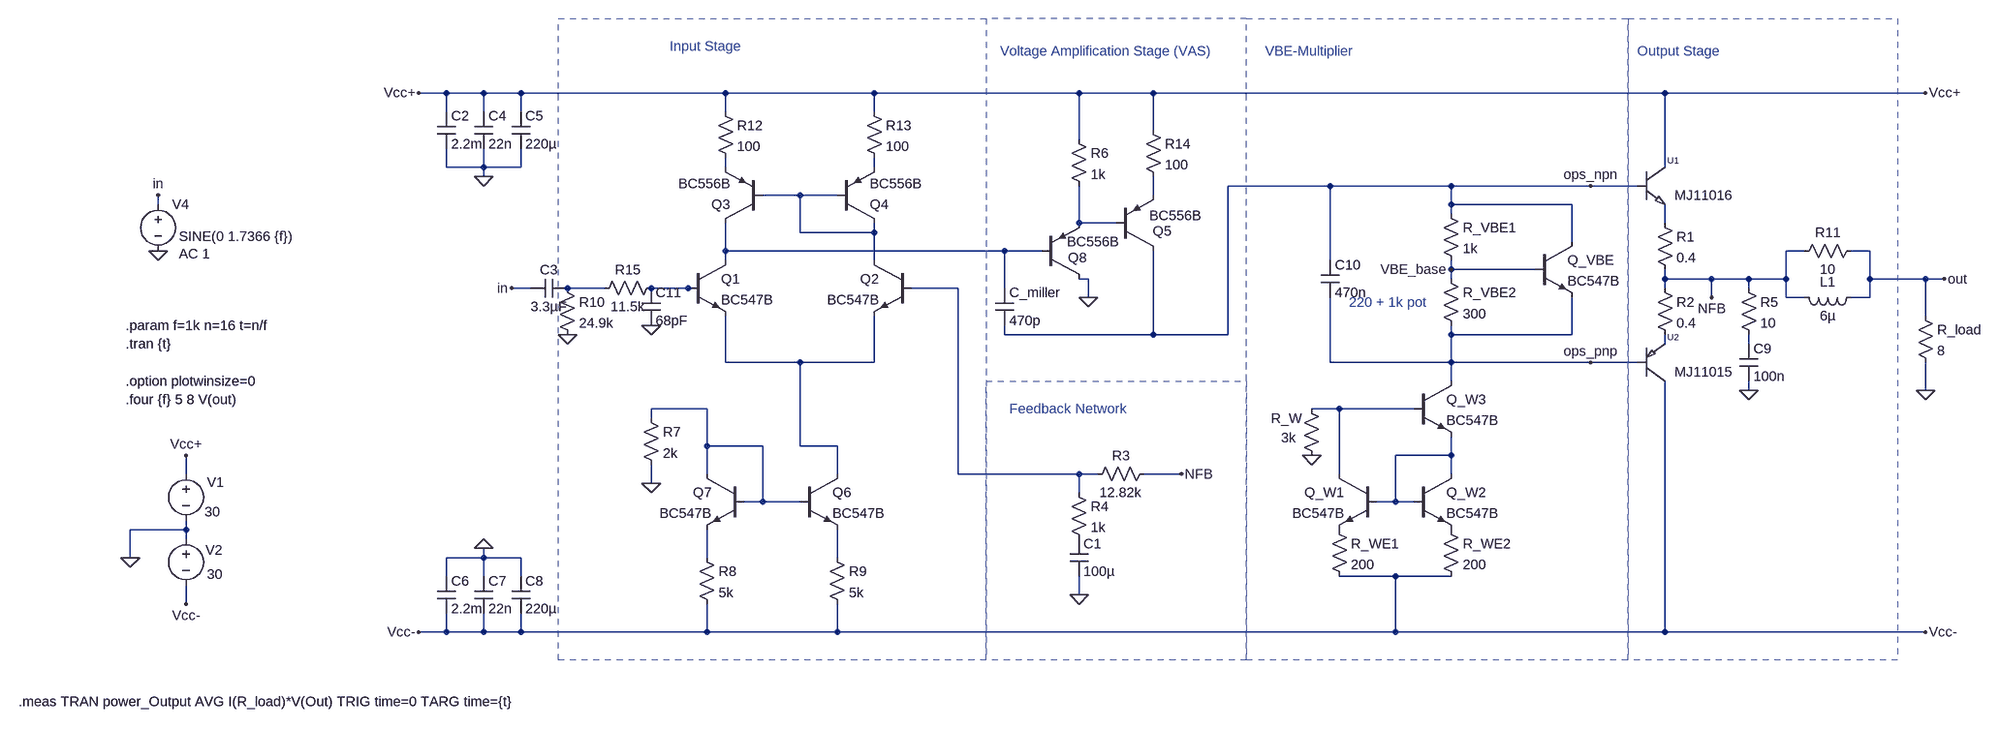
[diagram p0: schematic classABThreeStage.asc]
classABThreeStage.asc, the LTspice schematic file:
Version 4
SHEET 1 1384 792
WIRE -1392 -496 -1440 -496
WIRE -1328 -496 -1392 -496
WIRE -1264 -496 -1328 -496
WIRE -912 -496 -1264 -496
WIRE -656 -496 -912 -496
WIRE -304 -496 -656 -496
WIRE -176 -496 -304 -496
WIRE 704 -496 -176 -496
WIRE 1152 -496 704 -496
WIRE -1392 -464 -1392 -496
WIRE -1328 -464 -1328 -496
WIRE -1264 -464 -1264 -496
WIRE -912 -464 -912 -496
WIRE -656 -464 -656 -496
WIRE -176 -432 -176 -496
WIRE -304 -416 -304 -496
WIRE -1392 -368 -1392 -400
WIRE -1328 -368 -1328 -400
WIRE -1328 -368 -1392 -368
WIRE -1264 -368 -1264 -400
WIRE -1264 -368 -1328 -368
WIRE -912 -368 -912 -384
WIRE -656 -368 -656 -384
WIRE 704 -368 704 -496
WIRE -1328 -352 -1328 -368
WIRE 128 -336 -48 -336
WIRE 336 -336 128 -336
WIRE 576 -336 336 -336
WIRE 656 -336 576 -336
WIRE -784 -320 -848 -320
WIRE -720 -320 -784 -320
WIRE -176 -320 -176 -352
WIRE -1888 -304 -1888 -320
WIRE 336 -304 336 -336
WIRE 544 -304 336 -304
WIRE 336 -288 336 -304
WIRE -304 -272 -304 -336
WIRE -240 -272 -304 -272
WIRE 704 -272 704 -304
WIRE -784 -256 -784 -320
WIRE -656 -256 -656 -272
WIRE -656 -256 -784 -256
WIRE 544 -240 544 -304
WIRE -912 -224 -912 -272
WIRE -432 -224 -912 -224
WIRE -368 -224 -432 -224
WIRE 944 -224 912 -224
WIRE 1056 -224 1024 -224
WIRE -912 -208 -912 -224
WIRE -656 -208 -656 -256
WIRE 128 -208 128 -336
WIRE 336 -192 336 -208
WIRE 480 -192 336 -192
WIRE -288 -176 -304 -176
WIRE 336 -176 336 -192
WIRE 704 -176 704 -192
WIRE 784 -176 704 -176
WIRE 848 -176 784 -176
WIRE 912 -176 912 -224
WIRE 912 -176 848 -176
WIRE 1056 -176 1056 -224
WIRE 1152 -176 1056 -176
WIRE 1184 -176 1152 -176
WIRE -1248 -160 -1280 -160
WIRE -1120 -160 -1184 -160
WIRE -976 -160 -1040 -160
WIRE -960 -160 -976 -160
WIRE -512 -160 -592 -160
WIRE -432 -160 -432 -224
WIRE 704 -160 704 -176
WIRE 848 -160 848 -176
WIRE -288 -144 -288 -176
WIRE 784 -144 784 -176
WIRE 912 -144 912 -176
WIRE 944 -144 912 -144
WIRE 1056 -144 1056 -176
WIRE 1056 -144 1024 -144
WIRE 1152 -112 1152 -176
WIRE -432 -80 -432 -96
WIRE -176 -80 -176 -224
WIRE -176 -80 -432 -80
WIRE -48 -80 -48 -336
WIRE -48 -80 -176 -80
WIRE 336 -80 336 -96
WIRE 544 -80 544 -144
WIRE 544 -80 336 -80
WIRE 704 -64 704 -80
WIRE 848 -64 848 -80
WIRE -912 -32 -912 -112
WIRE -784 -32 -912 -32
WIRE -656 -32 -656 -112
WIRE -656 -32 -784 -32
WIRE 128 -32 128 -144
WIRE 336 -32 336 -80
WIRE 336 -32 128 -32
WIRE 576 -32 336 -32
WIRE 656 -32 576 -32
WIRE 336 0 336 -32
WIRE 848 16 848 0
WIRE 1152 16 1152 -32
WIRE -944 48 -1040 48
WIRE 144 48 96 48
WIRE 272 48 144 48
WIRE -1040 64 -1040 48
WIRE -944 112 -944 48
WIRE -848 112 -944 112
WIRE -784 112 -784 -32
WIRE -720 112 -784 112
WIRE 336 128 336 96
WIRE 336 128 240 128
WIRE -1840 160 -1840 128
WIRE -944 160 -944 112
WIRE -720 160 -720 112
WIRE -512 160 -512 -160
WIRE -304 160 -512 160
WIRE -272 160 -304 160
WIRE -128 160 -192 160
WIRE 144 160 144 48
WIRE 336 160 336 128
WIRE -1040 176 -1040 144
WIRE -304 192 -304 160
WIRE -848 208 -848 112
WIRE -848 208 -880 208
WIRE -784 208 -848 208
WIRE 240 208 240 128
WIRE 240 208 208 208
WIRE 272 208 240 208
WIRE -1840 256 -1840 240
WIRE -1840 256 -1936 256
WIRE -1840 272 -1840 256
WIRE -1936 304 -1936 256
WIRE -1328 304 -1328 288
WIRE -1328 304 -1392 304
WIRE -1264 304 -1328 304
WIRE -944 304 -944 256
WIRE -720 304 -720 256
WIRE -1392 336 -1392 304
WIRE -1328 336 -1328 304
WIRE -1264 336 -1264 304
WIRE 240 336 144 336
WIRE 336 336 240 336
WIRE -304 368 -304 336
WIRE -1840 384 -1840 352
WIRE -1392 432 -1392 400
WIRE -1392 432 -1440 432
WIRE -1328 432 -1328 400
WIRE -1328 432 -1392 432
WIRE -1264 432 -1264 400
WIRE -1264 432 -1328 432
WIRE -944 432 -944 384
WIRE -944 432 -1264 432
WIRE -720 432 -720 384
WIRE -720 432 -944 432
WIRE 240 432 240 336
WIRE 240 432 -720 432
WIRE 704 432 704 0
WIRE 704 432 240 432
WIRE 1152 432 704 432
FLAG 96 128 0
FLAG 1152 -496 Vcc+
FLAG -1840 384 Vcc-
FLAG -1840 128 Vcc+
FLAG 1152 16 0
FLAG -304 368 0
FLAG -1888 -224 0
FLAG -1888 -320 in
FLAG -1440 432 Vcc-
FLAG 1152 432 Vcc-
FLAG -1040 176 0
FLAG 576 -336 ops_npn
FLAG 576 -32 ops_pnp
FLAG 336 -192 VBE_base
FLAG -1936 304 0
FLAG -1440 -496 Vcc+
FLAG 784 -144 NFB
FLAG -128 160 NFB
FLAG -288 -144 0
FLAG -1328 -352 0
FLAG -1328 288 0
FLAG 848 16 0
FLAG 1184 -176 out
FLAG -1280 -160 in
FLAG -1040 -96 0
FLAG -1184 -80 0
SYMBOL npn 272 160 R0
SYMATTR InstName Q_W2
SYMATTR Value BC547B
SYMBOL npn 208 160 M0
SYMATTR InstName Q_W1
SYMATTR Value BC547B
SYMBOL res 128 240 R0
SYMATTR InstName R_WE1
SYMATTR Value 200
SYMBOL res 320 240 R0
SYMATTR InstName R_WE2
SYMATTR Value 200
SYMBOL npn 272 0 R0
SYMATTR InstName Q_W3
SYMATTR Value BC547B
SYMBOL res 80 32 R0
WINDOW 0 -54 32 Left 2
WINDOW 3 -36 66 Left 2
SYMATTR InstName R_W
SYMATTR Value 3k
SYMBOL res 320 -192 R0
SYMATTR InstName R_VBE2
SYMATTR Value 300
SYMBOL res 320 -304 R0
SYMATTR InstName R_VBE1
SYMATTR Value 1k
SYMBOL npn 480 -240 R0
SYMATTR InstName Q_VBE
SYMATTR Value BC547B
SYMBOL res 1136 -128 R0
SYMATTR InstName R_load
SYMATTR Value 8
SYMBOL res 688 -288 R0
SYMATTR InstName R1
SYMATTR Value 0.4
SYMBOL res 688 -176 R0
SYMATTR InstName R2
SYMATTR Value 0.4
SYMBOL npn -976 -208 R0
SYMATTR InstName Q1
SYMATTR Value BC547B
SYMBOL npn -592 -208 M0
SYMATTR InstName Q2
SYMATTR Value BC547B
SYMBOL pnp -848 -272 R180
SYMATTR InstName Q3
SYMATTR Value BC556B
SYMBOL pnp -720 -272 M180
SYMATTR InstName Q4
SYMATTR Value BC556B
SYMBOL pnp -240 -224 M180
WINDOW 0 63 34 Left 2
WINDOW 3 57 61 Left 2
SYMATTR InstName Q5
SYMATTR Value BC556B
SYMBOL res -176 144 R90
WINDOW 0 0 56 VBottom 2
WINDOW 3 32 56 VTop 2
SYMATTR InstName R3
SYMATTR Value 12.82k
SYMBOL res -320 176 R0
SYMATTR InstName R4
SYMATTR Value 1k
SYMBOL cap -320 272 R0
SYMATTR InstName C1
SYMATTR Value 100µ
SYMBOL cap -448 -160 R0
SYMATTR InstName C_miller
SYMATTR Value 470p
SYMBOL res -320 -432 R0
SYMATTR InstName R6
SYMATTR Value 1k
SYMBOL voltage -1888 -320 R0
WINDOW 123 36 101 Left 2
WINDOW 39 0 0 Left 0
WINDOW 3 36 71 Left 2
SYMATTR Value2 AC 1
SYMATTR Value SINE(0 1.7366 {f})
SYMATTR InstName V4
SYMBOL npn -784 160 R0
SYMATTR InstName Q6
SYMATTR Value BC547B
SYMBOL npn -880 160 M0
SYMATTR InstName Q7
SYMATTR Value BC547B
SYMBOL res -1056 48 R0
SYMATTR InstName R7
SYMATTR Value 2k
SYMBOL res -960 288 R0
SYMATTR InstName R8
SYMATTR Value 5k
SYMBOL res -736 288 R0
SYMATTR InstName R9
SYMATTR Value 5k
SYMBOL voltage -1840 144 R0
WINDOW 0 36 30 Left 2
WINDOW 3 32 81 Left 2
WINDOW 123 0 0 Left 0
WINDOW 39 0 0 Left 0
SYMATTR InstName V1
SYMATTR Value 30
SYMBOL voltage -1840 256 R0
WINDOW 0 34 35 Left 2
WINDOW 3 36 77 Left 2
WINDOW 123 0 0 Left 0
WINDOW 39 0 0 Left 0
SYMATTR InstName V2
SYMATTR Value 30
SYMBOL mj11016 704 -336 R0
SYMATTR InstName U1
SYMBOL mj11015 704 -32 R0
SYMATTR InstName U2
SYMBOL res -928 -480 R0
SYMATTR InstName R12
SYMATTR Value 100
SYMBOL res -672 -480 R0
SYMATTR InstName R13
SYMATTR Value 100
SYMBOL pnp -368 -176 M180
WINDOW 0 45 36 Left 2
WINDOW 3 43 64 Left 2
SYMATTR InstName Q8
SYMATTR Value BC556B
SYMBOL cap -1408 -464 R0
SYMATTR InstName C2
SYMATTR Value 2.2m
SYMBOL cap -1344 -464 R0
SYMATTR InstName C4
SYMATTR Value 22n
SYMBOL cap -1280 -464 R0
SYMATTR InstName C5
SYMATTR Value 220µ
SYMBOL cap -1408 336 R0
SYMATTR InstName C6
SYMATTR Value 2.2m
SYMBOL cap -1344 336 R0
SYMATTR InstName C7
SYMATTR Value 22n
SYMBOL cap -1280 336 R0
SYMATTR InstName C8
SYMATTR Value 220µ
SYMBOL res 832 -176 R0
SYMATTR InstName R5
SYMATTR Value 10
SYMBOL cap 832 -64 R0
SYMATTR InstName C9
SYMATTR Value 100n
SYMBOL res 1040 -240 R90
WINDOW 0 0 56 VBottom 2
WINDOW 3 32 56 VTop 2
SYMATTR InstName R11
SYMATTR Value 10
SYMBOL ind 1040 -160 R90
WINDOW 0 5 56 VBottom 2
WINDOW 3 32 56 VTop 2
SYMATTR InstName L1
SYMATTR Value 6µ
SYMBOL cap 112 -208 R0
SYMATTR InstName C10
SYMATTR Value 470n
SYMBOL res -192 -448 R0
SYMATTR InstName R14
SYMATTR Value 100
SYMBOL cap -1184 -176 R90
WINDOW 0 0 32 VBottom 2
WINDOW 3 32 32 VTop 2
SYMATTR InstName C3
SYMATTR Value 3.3µF
SYMBOL res -1200 -176 R0
SYMATTR InstName R10
SYMATTR Value 24.9k
SYMBOL res -1024 -176 R90
WINDOW 0 0 56 VBottom 2
WINDOW 3 32 56 VTop 2
SYMATTR InstName R15
SYMATTR Value 11.5k
SYMBOL cap -1056 -160 R0
SYMATTR InstName C11
SYMATTR Value 68pF
TEXT 16 -568 Left 2 ;VBE-Multiplier
TEXT -424 48 Left 2 ;Feedback Network
TEXT -440 -568 Left 2 ;Voltage Amplification Stage (VAS)
TEXT -1008 -576 Left 2 ;Input Stage
TEXT 656 -568 Left 2 ;Output Stage
TEXT -1944 -64 Left 2 !.tran {t}
TEXT -1944 0 Left 2 !.option plotwinsize=0
TEXT -1944 32 Left 2 !.four {f} 5 8 V(out)
TEXT -2128 552 Left 2 !.meas TRAN power_Output AVG I(R_load)*V(Out) TRIG time=0 TARG time={t}
TEXT -1944 -96 Left 2 !.param f=1k n=16 t=n/f
TEXT 160 -136 Left 2 ;220 + 1k pot
RECTANGLE Normal -464 0 -16 480 2
RECTANGLE Normal -16 -624 -464 0 2
RECTANGLE Normal 640 480 -16 -624 2
RECTANGLE Normal -464 480 -1200 -624 2
RECTANGLE Normal 1104 480 640 -624 2

The netlist it stands for:
* classABThreeStage.asc
Q_W2 N016 N016 P001 0 BC547B
Q_W1 N015 N016 P002 0 BC547B
R_WE1 P002 Vcc- 200
R_WE2 P001 Vcc- 200
Q_W3 ops_pnp N015 N016 0 BC547B
R_W N015 0 3k
R_VBE2 VBE_base ops_pnp 300
R_VBE1 ops_npn VBE_base 1k
Q_VBE ops_npn VBE_base ops_pnp 0 BC547B
R_load out 0 8
R1 N006 NFB 0.4
R2 NFB N011 0.4
Q1 N007 N009 N013 0 BC547B
Q2 N003 N010 N013 0 BC547B
Q3 N007 N003 N001 0 BC556B
Q4 N003 N003 N002 0 BC556B
Q5 ops_npn N005 N004 0 BC556B
R3 NFB N010 12.82k
R4 N010 P003 1k
C1 P003 0 100µ
C_miller N007 ops_npn 470p
R6 Vcc+ N005 1k
V4 in 0 SINE(0 1.7366 {f}) AC 1
Q6 N013 N014 N018 0 BC547B
Q7 N014 N014 N017 0 BC547B
R7 N014 0 2k
R8 N017 Vcc- 5k
R9 N018 Vcc- 5k
V1 Vcc+ 0 30
V2 0 Vcc- 30
XU1 Vcc+ ops_npn N006 MJ11016  ; pins 1 2 3
XU2 Vcc- ops_pnp N011 MJ11015  ; pins 1 2 3
R12 Vcc+ N001 100
R13 Vcc+ N002 100
Q8 0 N007 N005 0 BC556B
C2 Vcc+ 0 2.2m
C4 Vcc+ 0 22n
C5 Vcc+ 0 220µ
C6 0 Vcc- 2.2m
C7 0 Vcc- 22n
C8 0 Vcc- 220µ
R5 NFB N012 10
C9 N012 0 100n
R11 out NFB 10
L1 out NFB 6µ
C10 ops_npn ops_pnp 470n
R14 Vcc+ N004 100
C3 N008 in 3.3µF
R10 N008 0 24.9k
R15 N009 N008 11.5k
C11 N009 0 68pF
.model NPN NPN
.model PNP PNP
.lib standard.bjt
* VBE-Multiplier
* Feedback Network
* Voltage Amplification Stage (VAS)
* Input Stage
* Output Stage
.tran {t}
.option plotwinsize=0
.four {f} 5 8 V(out)
.meas TRAN power_Output AVG I(R_load)*V(Out) TRIG time=0 TARG time={t}
.param f=1k n=16 t=n/f
* 220 + 1k pot
.lib mj11016.lib
.lib mj11015.lib
.backanno
.end